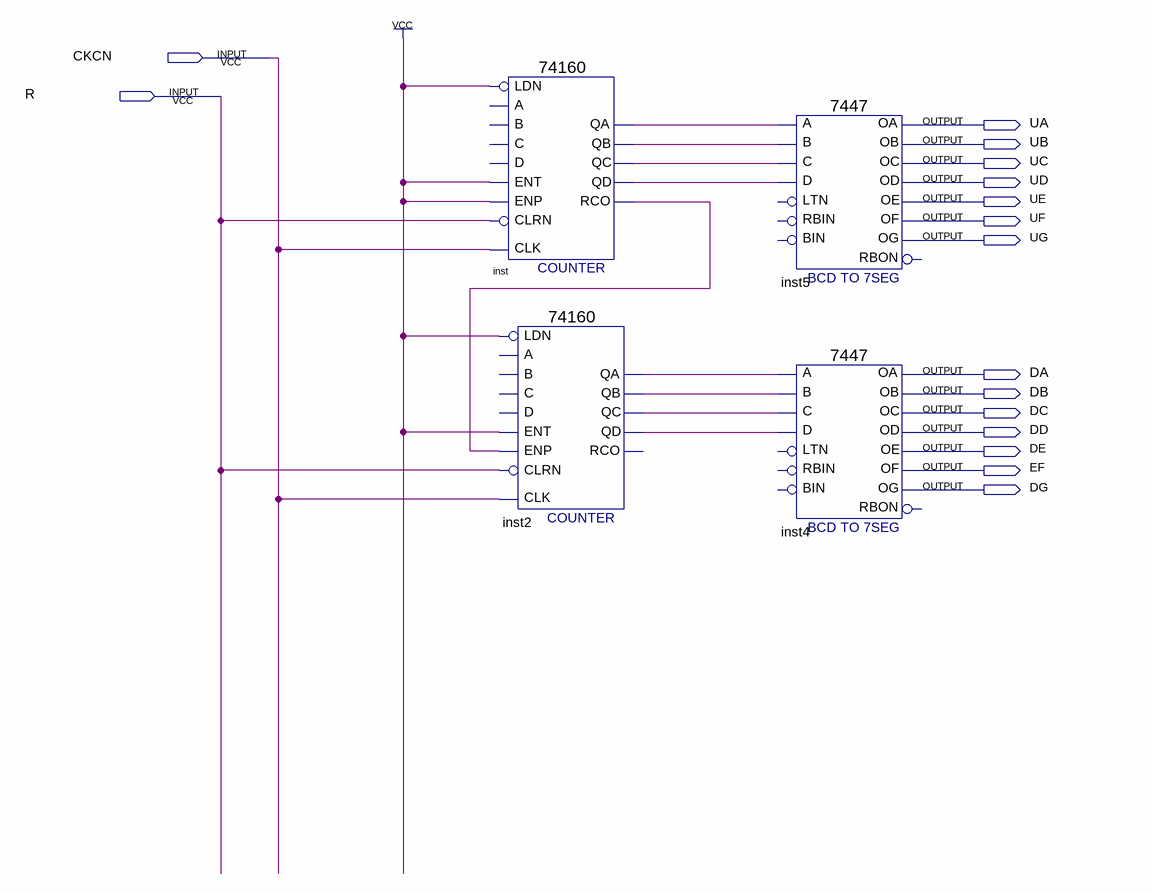
[diagram p0: schematic sheet]
// Quartus schematic contador_0_99.bdf as structural Verilog: 4 symbols, 16 pins
module contador_0_99 (
  input  CKCN,
  input  R,
  output UA,
  output UB,
  output UC,
  output UD,
  output UE,
  output UF,
  output UG,
  output DA,
  output DB,
  output DC,
  output DD,
  output DE,
  output EF,
  output DG
);

  wire inst2_qa, inst2_qb, inst2_qc, inst2_qd, inst_qa, inst_qb, inst_qc, inst_qd, inst_rco;

  \74160  inst (
    .CLK(CKCN), .ENT(1'b1), .LDN(1'b1), .ENP(1'b1), .CLRN(R), .QD(inst_qd), .QA(inst_qa), .QB(inst_qb),
    .QC(inst_qc), .RCO(inst_rco));  // open: A, B, C, D
  \74160  inst2 (
    .CLK(CKCN), .ENT(1'b1), .LDN(1'b1), .ENP(inst_rco), .CLRN(R), .QD(inst2_qd), .QA(inst2_qa),
    .QB(inst2_qb), .QC(inst2_qc));  // open: A, B, C, D, RCO
  \7447  inst5 (
    .B(inst_qb), .C(inst_qc), .D(inst_qd), .A(inst_qa), .OB(UB), .OC(UC), .OE(UE), .OD(UD), .OF(UF), .OG(UG),
    .OA(UA));  // open: LTN, RBIN, BIN, RBON
  \7447  inst4 (
    .B(inst2_qb), .C(inst2_qc), .D(inst2_qd), .A(inst2_qa), .OB(DB), .OC(DC), .OE(DE), .OD(DD), .OF(EF),
    .OG(DG), .OA(DA));  // open: LTN, RBIN, BIN, RBON
endmodule
